# EAGLE schematic Xduino6.0 (EAGLE 6.5.0)
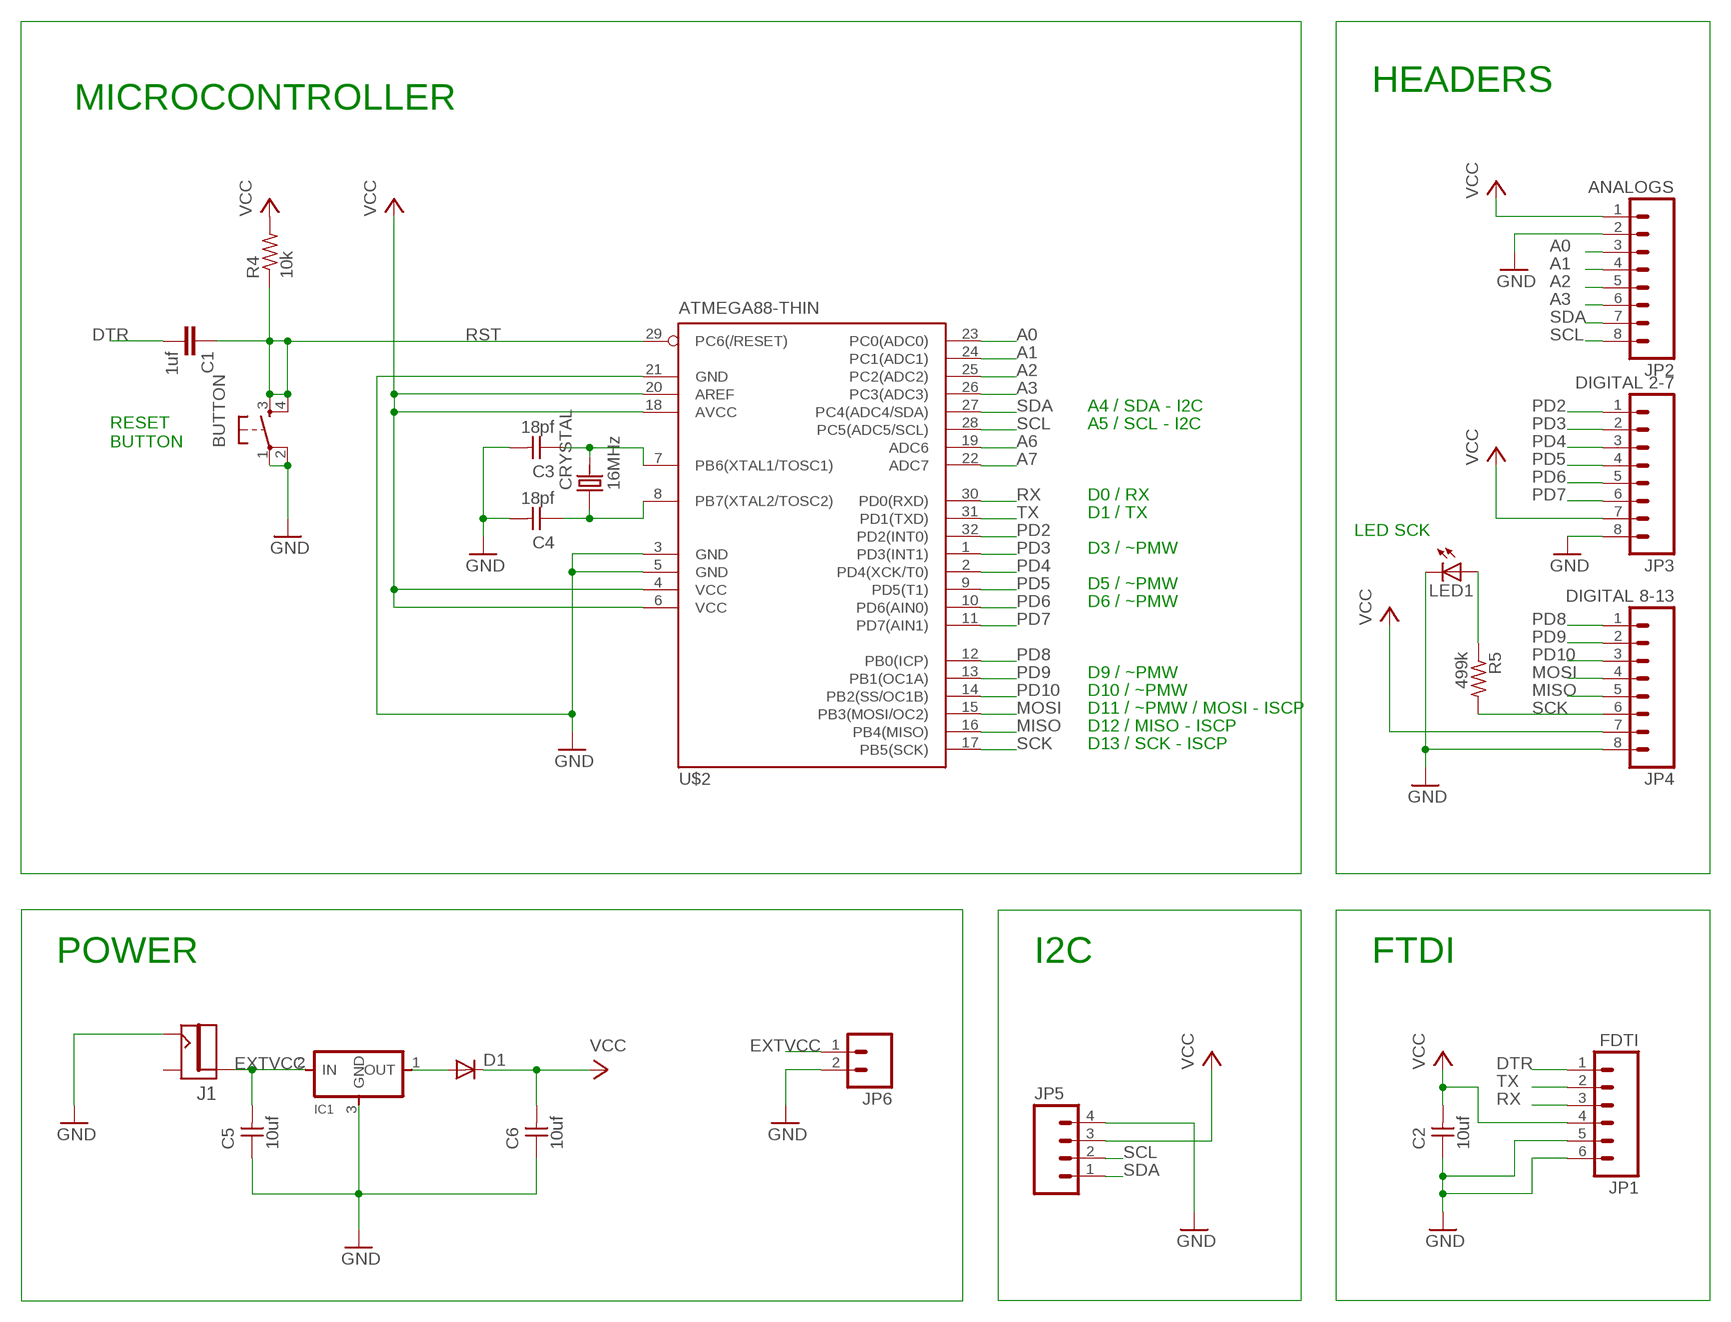
[diagram p0: schematic, sheet 1]

## Parts
BUTTON  6MM_SWITCH6MM_SWITCH  [6MM_SWITCH]
C1  1uf  CAP1206  [1206]
C2  10uf  UNPOLARIZED_CAPACITOR1206  [1206]
C3  18pf  UNPOLARIZED_CAPACITOR1206  [1206]
C4  18pf  UNPOLARIZED_CAPACITOR1206  [1206]
C5  10uf  UNPOLARIZED_CAPACITOR1206  [1206]
C6  10uf  UNPOLARIZED_CAPACITOR1206  [1206]
CRYSTAL  16MHz  CRYSTALCS10  [CS10]
D1  DIODESOD123  [SOD123]
IC1  REGULATORSOT23  [SOT23]
J1  JACK.65MM  [JACK_.65MM]
JP1  FDTI  M061X06-SMD_EDGE_FEMALE  [1X06-SMD_EDGE]
JP2  ANALOGS  M08  [1X08]
JP3  DIGITAL 2-7  M08  [1X08]
JP4  DIGITAL 8-13  M08  [1X08]
JP5  M04PTH  [1X04]
JP6  M02PTH  [1X02]
LED1  LED1206  [1206]
R4  10k  RESISTOR1206  [1206]
R5  499k  RESISTOR1206  [1206]
U$2  ATMEGA88-THIN  [TQFP32-08THIN]

## Nets
A0: JP2.3 U$2.23(PC0(ADC0))
A1: JP2.4 U$2.24(PC1(ADC1))
A2: JP2.5 U$2.25(PC2(ADC2))
A3: JP2.6 U$2.26(PC3(ADC3))
A6: U$2.19(ADC6)
A7: U$2.22(ADC7)
DTR: C1.2 JP1.1
EXTVCC: C5.2 IC1.2(IN) J1.PIN JP6.1
GND: BUTTON.1(P) BUTTON.2(P1) C2.1 C3.2 C4.2 C5.1 C6.1 IC1.3(GND) J1.SHUNT(CONTACT) JP1.5 JP1.6 JP2.2 JP3.8 JP4.8 JP5.4 JP6.2 LED1.2(C) U$2.3(GND) U$2.5(GND) U$2.21(GND)
MISO: JP4.5 U$2.16(PB4(MISO))
MOSI: JP4.4 U$2.15(PB3(MOSI/OC2))
N$2: LED1.1(A) R5.1
N$10: C4.1 CRYSTAL.P$1 U$2.8(PB7(XTAL2/TOSC2))
N$11: C3.1 CRYSTAL.P$2 U$2.7(PB6(XTAL1/TOSC1))
N$12: D1.ANODE(A) IC1.1(OUT)
PD2: JP3.1 U$2.32(PD2(INT0))
PD3: JP3.2 U$2.1(PD3(INT1))
PD4: JP3.3 U$2.2(PD4(XCK/T0))
PD5: JP3.4 U$2.9(PD5(T1))
PD6: JP3.5 U$2.10(PD6(AIN0))
PD7: JP3.6 U$2.11(PD7(AIN1))
PD8: JP4.1 U$2.12(PB0(ICP))
PD9: JP4.2 U$2.13(PB1(OC1A))
PD10: JP4.3 U$2.14(PB2(SS/OC1B))
RST: BUTTON.3(S) BUTTON.4(S1) C1.1 R4.1 U$2.29(PC6(/RESET))
RX: JP1.3 U$2.30(PD0(RXD))
SCK: JP4.6 R5.2 U$2.17(PB5(SCK))
SCL: JP2.8 JP5.2 U$2.28(PC5(ADC5/SCL))
SDA: JP2.7 JP5.1 U$2.27(PC4(ADC4/SDA))
TX: JP1.2 U$2.31(PD1(TXD))
VCC: C2.2 C6.2 D1.CATHODE(C) JP1.4 JP2.1 JP3.7 JP4.7 JP5.3 R4.2 U$2.4(VCC) U$2.6(VCC) U$2.18(AVCC) U$2.20(AREF)
Unconnected: J1.CONTACT(SHUNT)

## Notes on the sheet
- HEADERS
- MICROCONTROLLER
- A4 / SDA - I2C
- A5 / SCL - I2C
- RESET 
  BUTTON
- D0 / RX
- D1 / TX
- LED SCK
- D3 / ~PMW
- D5 / ~PMW
- D6 / ~PMW
- D9 / ~PMW
- D10 / ~PMW
- D11 / ~PMW / MOSI - ISCP
- D12 / MISO - ISCP
- D13 / SCK - ISCP
- POWER | I2C | FTDI

## Library data of the parts
BUTTON = 01_fab:6MM_SWITCH: OMRON SWITCH
C1 = 01_SparkFun:CAP: Capacitor Standard 0603 ceramic capacitor, and 0.1" leaded capacitor.
C2-C6 = 01_FAB_Hello:UNPOLARIZED_CAPACITOR: unpolarized_capacitor
CRYSTAL = 01_ng:CRYSTAL: CRYSTAL
D1 = 01_fab:DIODE: DIODE high speed (Philips)
IC1 = 01_fab:REGULATOR
J1 = 01_fab:JACK
JP1 = 01_SparkFun:M06: Header 6 Standard 6-pin 0.1" header. Use with straight break away headers (SKU : PRT-00116), right angle break away headers (PRT-00553), swiss pins (PRT-00743), machine pins (PRT-00117), and female headers (PRT-00115). Molex polarized connector foot print use with SKU : PRT-08094 with associated crimp pins and housings. NOTES ON THE VARIANTS LOCK and LOCK_LONGPADS... This footprint was designed to help hold the alignment of a through-hole component (i.e. 6-pin header) while soldering it into place. You may notice that each hole has been shifted either up or down by 0.005 of an inch from it's more standard position (which is a perfectly straight line). This slight alteration caused the pins (the squares in the middle) to touch the edges of the holes. Because they are alternating, it causes a "brace" to hold the component in place. 0.005 has proven to be the perfect amount of "off-center" position when using our standard breakaway headers. Although looks a little odd when you look at the bare footprint, once you have a header in there, the alteration is very hard to notice. Also, if you push a header all the way into place, it is covered up entirely on the bottom side. This idea of altering the position of holes to aid alignment will be further integrated into the Sparkfun Library for other footprints. It can help hold any component with 3 or more connection pins.
JP2-JP4 = 01_SparkFun:M08: Header 8 Standard 8-pin 0.1" header. Use with straight break away headers (SKU : PRT-00116), right angle break away headers (PRT-00553), swiss pins (PRT-00743), machine pins (PRT-00117), and female headers (PRT-00115).
JP5 = 01_SparkFun:M04: Header 4 Standard 4-pin 0.1" header. Use with straight break away headers (SKU : PRT-00116), right angle break away headers (PRT-00553), swiss pins (PRT-00743), machine pins (PRT-00117), and female headers (PRT-00115). Molex polarized connector foot print use with SKU : PRT-08231 with associated crimp pins and housings.
JP6 = 01_SparkFun:M02: Header 2 Standard 2-pin 0.1" header. Use with straight break away headers (SKU : PRT-00116), right angle break away headers (PRT-00553), swiss pins (PRT-00743), machine pins (PRT-00117), and female headers (PRT-00115). Molex polarized connector foot print use with SKU : PRT-08233 with associated crimp pins and housings.
LED1 = 01_ng:LED
R4 = 01_FAB_Hello:RESISTOR
R5 = 01_ng:RESISTOR
U$2 = 01_fab:ATMEGA88-THIN